# Altium schematic sheet EMG.SchDoc
size Letter
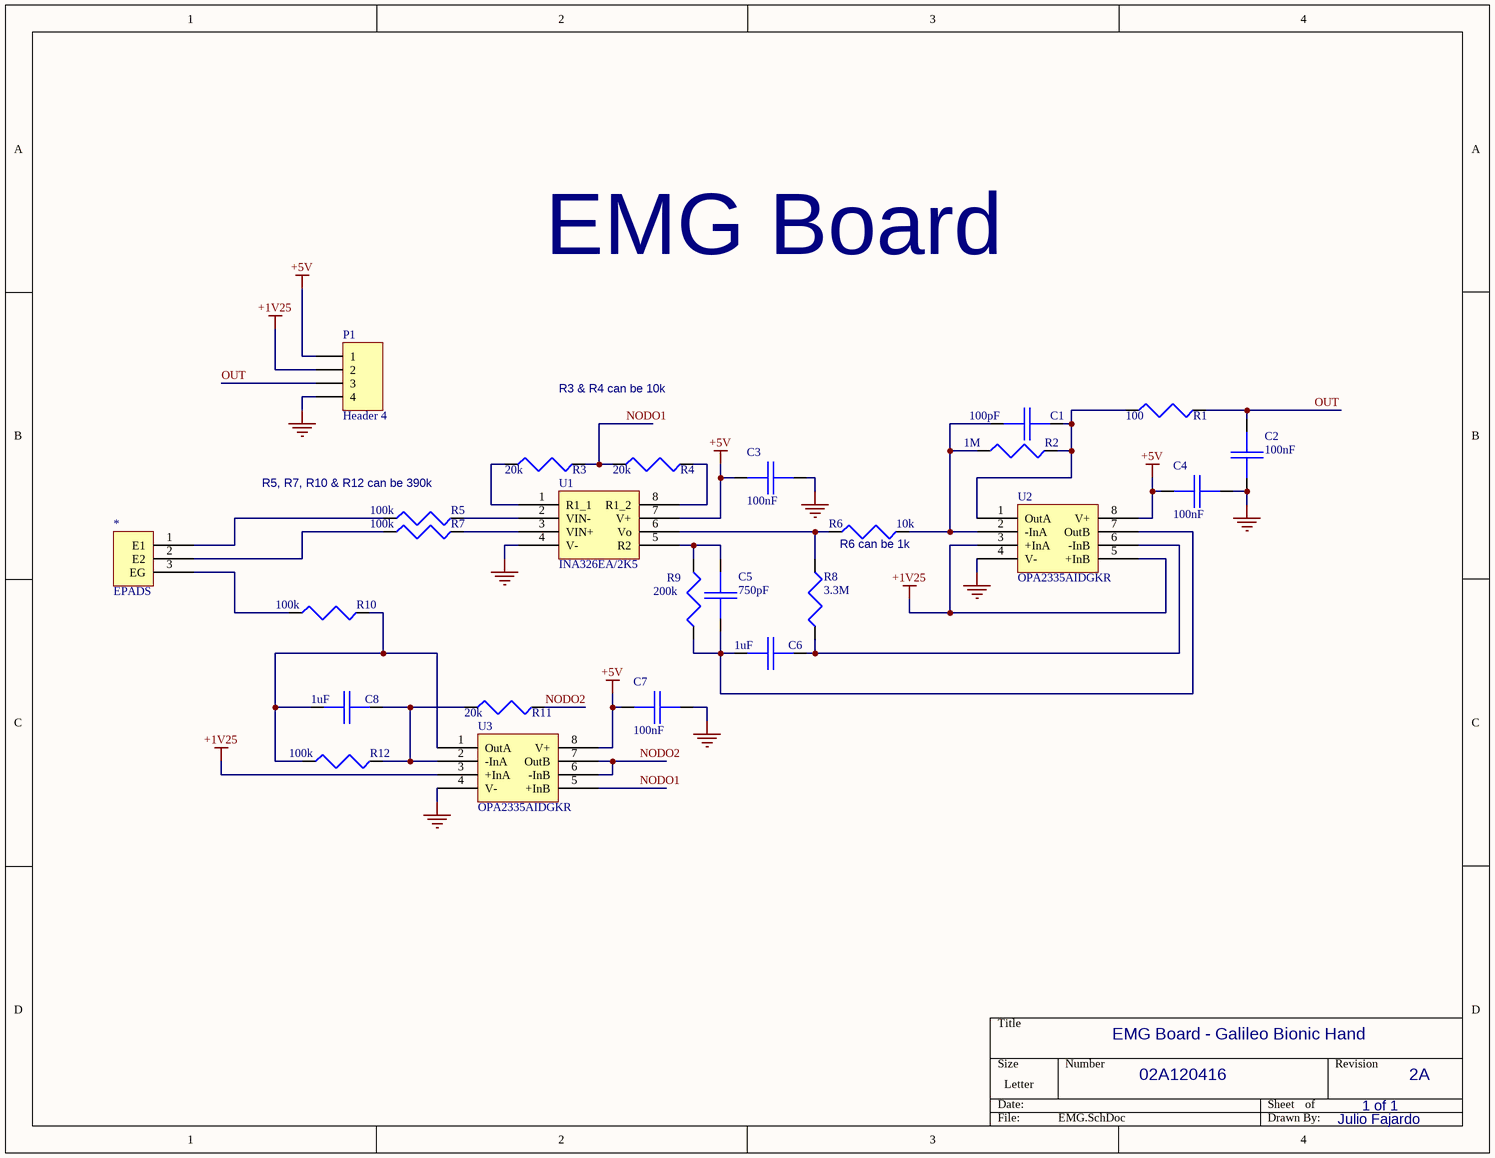
[diagram p0: EMG.SchDoc]

## Parts
*  EPADS  [PADS]
C1  100pF  [C0603]
C2  100nF  [C0603]
C3  100nF  [C0603]
C4  100nF  [C0603]
C5  750pF  [C0603]
C6  1uF  [C0603]
C7  100nF  [C0603]
C8  1uF  [C0603]
P1  Header 4  [HDR1X4]
R1  100  [R0603]
R2  1M  [R0603]
R3  20k  [R0603]
R4  20k  [R0603]
R5  100k  [R0603]
R6  10k  [R0603]
R7  100k  [R0603]
R8  3.3M  [R0402]
R9  200k  [R0603]
R10  100k  [R0603]
R11  20k  [R0603]
R12  100k  [R0603]
U1  INA326EA/2K5  [VSOP8]
U2  OPA2335AIDGKR  [VSOP8]
U3  OPA2335AIDGKR  [VSOP8]

## Nets
+1V25: P1.2 U2.3(+InA) U2.5(+InB) U3.3(+InA)
+5V: C3.2 C4.2 C7.2 P1.1 U1.7(V+) U2.8(V+) U3.8(V+)
GND: C2.2 C3.1 C4.1 C7.1 P1.4 U1.4(V-) U2.4(V-) U3.4(V-)
NODO1: R3.2 R4.1 U3.5(+InB)
NODO2: R11.2 U3.6(-InB) U3.7(OutB)
OUT: C2.1 P1.3 R1.2
Net*_1: *.1(E1) R5.1
Net*_2: *.2(E2) R7.1
Net*_3: *.3(EG) R10.1
NetC1_1: C1.1 R2.1 R6.2 U2.2(-InA)
NetC1_2: C1.2 R1.1 R2.2 U2.1(OutA)
NetC5_1: C5.1 C6.1 R9.1 U2.7(OutB)
NetC5_2: C5.2 R9.2 U1.5(R2)
NetC6_2: C6.2 R8.1 U2.6(-InB)
NetC8_1: C8.1 R10.2 R12.1 U3.1(OutA)
NetC8_2: C8.2 R11.1 R12.2 U3.2(-InA)
NetR3_1: R3.1 U1.1(R1_1)
NetR4_2: R4.2 U1.8(R1_2)
NetR5_2: R5.2 U1.2(VIN-)
NetR6_1: R6.1 R8.2 U1.6(Vo)
NetR7_2: R7.2 U1.3(VIN+)

## Notes on the sheet
- EMG Board
- R3 & R4 can be 10k
- R5, R7, R10 & R12 can be 390k
- (near R6) R6 can be 1k
- EMG Board - Galileo Bionic Hand
- 02A120416
- 1 of 1
- 2A
- Julio Fajardo

## Library data of the parts
* = PADS
C1 = 06033C101KAT2A: CAP CER 100PF 25V X7R 0603; Manufacturer: AVX Corporation; Tolerance: ±10%; Supplier 1: Digi-Key; Manufacturer Part Number: 06033C101KAT2A; RoHS: RoHS Compliant; Category: Capacitors; Stock 1: 34346; Pricing 1: 1=0.23, 10=0.157, 100=0.0798, 250=0.0646, 500=0.057, 1000=0.04845 (USD); Packaging: Cut Tape (CT); Capacitance: 100pF; Voltage - Rated: 25V; Temperature Coefficient: X7R; Mounting Type: Surface Mount, MLCC; Operating Temperature: -55°C ~ 125°C; Applications: General Purpose; Ratings: -; Package / Case: 0603 (1608 Metric); Size / Dimension: 0.063" L x 0.032" W (1.60mm x 0.81mm); Height - Seated (Max): -; Thickness (Max): 0.035" (0.90mm); Lead Spacing: -; Features: -; Lead Style: -; ComponentLink1URL: http://datasheets.avx.com/X7RDielectric.pdf; ComponentLink1Description: http://datasheets.avx.com/X7RDielectric.pdf; Supplier Part Number 1: 478-7899-1-ND
C2-C4 C7 = GRM188R71E104KA01D: CAP CER 0.1UF 25V X7R 0603; Manufacturer: Murata Electronics North America; Capacitance: 0.1µF; Tolerance: ±10%; Supplier 1: Digi-Key; Manufacturer Part Number: GRM188R71E104KA01D; RoHS: RoHS Compliant; Category: Capacitors; Stock 1: 5973420; Pricing 1: 1=0.1, 10=0.019, 50=0.0104, 100=0.0088, 250=0.0072, 500=0.00616, 1000=0.0048 (USD); Packaging: Cut Tape (CT); Voltage - Rated: 25V; Temperature Coefficient: X7R; Mounting Type: Surface Mount, MLCC; Operating Temperature: -55°C ~ 125°C; Applications: General Purpose; Ratings: -; Package / Case: 0603 (1608 Metric); Size / Dimension: 0.063" L x 0.031" W (1.60mm x 0.80mm); Height - Seated (Max): -; Thickness (Max): 0.035" (0.90mm); Lead Spacing: -; Features: -; Lead Style: -; ComponentLink1URL: http://www.murata.com/~/media/webrenewal/support/library/catalog/products/capacitor/mlcc/c02e.pdf; ComponentLink1Description: http://www.murata.com/~/media/webrenewal/support/library/catalog/products/capacitor/mlcc/c02e.pdf; Supplier Part Number 1: 490-1524-1-ND
C5 = GRM1885C1H751JA01D: CAP CER 750PF 50V NP0 0603; Manufacturer: Murata Electronics North America; Tolerance: ±5%; Temperature Coefficient: C0G, NP0; Supplier 1: Digi-Key; Manufacturer Part Number: GRM1885C1H751JA01D; RoHS: RoHS Compliant; Category: Capacitors; Stock 1: 30475; Pricing 1: 1=0.16, 10=0.112, 25=0.084, 50=0.0644, 100=0.0532, 250=0.0448, 500=0.03752, 1000=0.0308 (USD); Packaging: Cut Tape (CT); Capacitance: 750pF; Voltage - Rated: 50V; Mounting Type: Surface Mount, MLCC; Operating Temperature: -55°C ~ 125°C; Applications: General Purpose; Ratings: -; Package / Case: 0603 (1608 Metric); Size / Dimension: 0.063" L x 0.031" W (1.60mm x 0.80mm); Height - Seated (Max): -; Thickness (Max): 0.035" (0.90mm); Lead Spacing: -; Features: -; Lead Style: -; ComponentLink1URL: http://www.murata.com/~/media/webrenewal/support/library/catalog/products/capacitor/mlcc/c02e.pdf; ComponentLink1Description: http://www.murata.com/~/media/webrenewal/support/library/catalog/products/capacitor/mlcc/c02e.pdf; Supplier Part Number 1: 490-1448-1-ND
C6 C8 = GRM188R61E105KA12D: CAP CER 1UF 25V X5R 0603; Manufacturer: Murata Electronics North America; Capacitance: 1µF; Tolerance: ±10%; Supplier 1: Digi-Key; Manufacturer Part Number: GRM188R61E105KA12D; RoHS: RoHS Compliant; Category: Capacitors; Stock 1: 1934941; Pricing 1: 1=0.1, 10=0.044, 50=0.0238, 100=0.0202, 250=0.01652, 500=0.01412, 1000=0.01101 (USD); Packaging: Cut Tape (CT); Voltage - Rated: 25V; Temperature Coefficient: X5R; Mounting Type: Surface Mount, MLCC; Operating Temperature: -55°C ~ 85°C; Applications: General Purpose; Ratings: -; Package / Case: 0603 (1608 Metric); Size / Dimension: 0.063" L x 0.031" W (1.60mm x 0.80mm); Height - Seated (Max): -; Thickness (Max): 0.035" (0.90mm); Lead Spacing: -; Features: -; Lead Style: -; ComponentLink1URL: http://www.murata.com/~/media/webrenewal/support/library/catalog/products/capacitor/mlcc/c02e.pdf; ComponentLink1Description: http://www.murata.com/~/media/webrenewal/support/library/catalog/products/capacitor/mlcc/c02e.pdf; Supplier Part Number 1: 490-3897-1-ND
P1 = Header 4: Header, 4-Pin; LatestRevisionDate: 17-Jul-2002; LatestRevisionNote: Re-released for DXP Platform.; Publisher: Altium Limited
R1 = ERJ-3EKF1000V: RES SMD 100 OHM 1% 1/10W 0603; Manufacturer: Panasonic Electronic Components; Power (Watts): 0.1W, 1/10W; Temperature Coefficient: ±100ppm/°C; Supplier 1: Digi-Key; Manufacturer Part Number: ERJ-3EKF1000V; RoHS: RoHS Compliant; Category: Resistors; Stock 1: 2225240; Pricing 1: 1=0.1, 50=0.0114, 100=0.0084, 250=0.00644, 500=0.00514, 1000=0.00379 (USD); Packaging: Cut Tape (CT); Resistance (Ohms): 100; Tolerance: ±1%; Composition: Thick Film; Features: Automotive AEC-Q200; Operating Temperature: -55°C ~ 155°C; Package / Case: 0603 (1608 Metric); Supplier Device Package: 0603; Size / Dimension: 0.063" L x 0.031" W (1.60mm x 0.80mm); Height: 0.022" (0.55mm); Number of Terminations: 2; ComponentLink1URL: http://industrial.panasonic.com/www-cgi/jvcr13pz.cgi?E+PZ+3+AOA0002+ERJ3EKF1000V+7+WW; ComponentLink1Description: http://industrial.panasonic.com/www-cgi/jvcr13pz.cgi?E+PZ+3+AOA0002+ERJ3EKF1000V+7+WW; Supplier Part Number 1: P100HCT-ND
R2 = MCT06030C1004FP500: RES SMD 1M OHM 1% 1/8W 0603; Manufacturer: Vishay Beyschlag; Power (Watts): 0.125W, 1/8W; Temperature Coefficient: ±50ppm/°C; Supplier 1: Digi-Key; Manufacturer Part Number: MCT06030C1004FP500; RoHS: RoHS Compliant; Category: Resistors; Stock 1: 53165; Pricing 1: 1=0.17, 10=0.145, 25=0.1056, 50=0.0766, 100=0.0568, 250=0.04356, 500=0.03432, 1000=0.02376, 2500=0.02178 (USD); Packaging: Cut Tape (CT); Resistance (Ohms): 1M; Tolerance: ±1%; Composition: Thin Film; Features: -; Operating Temperature: -55°C ~ 155°C; Package / Case: 0603 (1608 Metric); Supplier Device Package: 0603; Size / Dimension: 0.061" L x 0.033" W (1.55mm x 0.85mm); Height: 0.022" (0.55mm); Number of Terminations: 2; ComponentLink1URL: http://www.vishay.com/docs/28705/mcx0x0xpro.pdf; ComponentLink1Description: http://www.vishay.com/docs/28705/mcx0x0xpro.pdf; Supplier Part Number 1: MCT0603-1.00M-CFCT-ND
R3 R4 R11 = ERJ-3EKF2002V: RES SMD 20K OHM 1% 1/10W 0603; Manufacturer: Panasonic Electronic Components; Power (Watts): 0.1W, 1/10W; Temperature Coefficient: ±100ppm/°C; Supplier 1: Digi-Key; Manufacturer Part Number: ERJ-3EKF2002V; RoHS: RoHS Compliant; Category: Resistors; Stock 1: 1307644; Pricing 1: 1=0.1, 50=0.0114, 100=0.0084, 250=0.00644, 500=0.00514, 1000=0.00379 (USD); Packaging: Cut Tape (CT); Resistance (Ohms): 20k; Tolerance: ±1%; Composition: Thick Film; Features: Automotive AEC-Q200; Operating Temperature: -55°C ~ 155°C; Package / Case: 0603 (1608 Metric); Supplier Device Package: 0603; Size / Dimension: 0.063" L x 0.031" W (1.60mm x 0.80mm); Height: 0.022" (0.55mm); Number of Terminations: 2; ComponentLink1URL: http://industrial.panasonic.com/www-cgi/jvcr13pz.cgi?E+PZ+3+AOA0002+ERJ3EKF2002V+7+WW; ComponentLink1Description: http://industrial.panasonic.com/www-cgi/jvcr13pz.cgi?E+PZ+3+AOA0002+ERJ3EKF2002V+7+WW; Supplier Part Number 1: P20.0KHCT-ND
R5 R7 R10 R12 = MCT06030C1003FP500: RES SMD 100K OHM 1% 1/8W 0603; Manufacturer: Vishay Beyschlag; Power (Watts): 0.125W, 1/8W; Temperature Coefficient: ±50ppm/°C; Supplier 1: Digi-Key; Manufacturer Part Number: MCT06030C1003FP500; RoHS: RoHS Compliant; Category: Resistors; Stock 1: 147182; Pricing 1: 1=0.17, 10=0.145, 25=0.1056, 50=0.0766, 100=0.0568, 250=0.04356, 500=0.03432, 1000=0.02376, 2500=0.02178 (USD); Packaging: Cut Tape (CT); Resistance (Ohms): 100k; Tolerance: ±1%; Composition: Thin Film; Features: -; Operating Temperature: -55°C ~ 155°C; Package / Case: 0603 (1608 Metric); Supplier Device Package: 0603; Size / Dimension: 0.061" L x 0.033" W (1.55mm x 0.85mm); Height: 0.022" (0.55mm); Number of Terminations: 2; ComponentLink1URL: http://www.vishay.com/docs/28705/mcx0x0xpro.pdf; ComponentLink1Description: http://www.vishay.com/docs/28705/mcx0x0xpro.pdf; Supplier Part Number 1: MCT0603-100K-CFCT-ND
R6 = MCT06030C1002FP500: RES SMD 10K OHM 1% 1/8W 0603; Manufacturer: Vishay Beyschlag; Power (Watts): 0.125W, 1/8W; Temperature Coefficient: ±50ppm/°C; Supplier 1: Digi-Key; Manufacturer Part Number: MCT06030C1002FP500; RoHS: RoHS Compliant; Category: Resistors; Stock 1: 54494; Pricing 1: 1=0.17, 10=0.145, 25=0.1056, 50=0.0766, 100=0.0568, 250=0.04356, 500=0.03432, 1000=0.02376, 2500=0.02178 (USD); Packaging: Cut Tape (CT); Resistance (Ohms): 10k; Tolerance: ±1%; Composition: Thin Film; Features: -; Operating Temperature: -55°C ~ 155°C; Package / Case: 0603 (1608 Metric); Supplier Device Package: 0603; Size / Dimension: 0.061" L x 0.033" W (1.55mm x 0.85mm); Height: 0.022" (0.55mm); Number of Terminations: 2; ComponentLink1URL: http://www.vishay.com/docs/28705/mcx0x0xpro.pdf; ComponentLink1Description: http://www.vishay.com/docs/28705/mcx0x0xpro.pdf; Supplier Part Number 1: MCT0603-10.0K-CFCT-ND
R8 = MCR01MRTJ335: RES SMD 3.3M OHM 5% 1/16W 0402; Manufacturer: Rohm Semiconductor; Power (Watts): 0.063W, 1/16W; Temperature Coefficient: ±200ppm/°C; Supplier 1: Digi-Key; Manufacturer Part Number: MCR01MRTJ335; RoHS: RoHS Compliant; Category: Resistors; Stock 1: 17860; Pricing 1: 1=0.1, 10=0.02, 25=0.0144, 100=0.0082, 250=0.00624, 500=0.00498, 1000=0.00367, 5000=0.00263 (USD); Packaging: Cut Tape (CT); Resistance (Ohms): 3.3M; Tolerance: ±5%; Composition: Thick Film; Features: -; Operating Temperature: -55°C ~ 155°C; Package / Case: 0402 (1005 Metric); Supplier Device Package: 0402 (1005 Metric); Size / Dimension: 0.039" L x 0.020" W (1.00mm x 0.50mm); Height: 0.016" (0.40mm); Number of Terminations: 2; ComponentLink1URL: http://rohmfs.rohm.com/en/products/databook/datasheet/passive/resistor/chip_resistor/mcr_g.pdf; ComponentLink1Description: http://rohmfs.rohm.com/en/products/databook/datasheet/passive/resistor/chip_resistor/mcr_g.pdf; Supplier Part Number 1: RHM3.3MCECT-ND
R9 = MCT06030C2003FP500: RES SMD 200K OHM 1% 1/8W 0603; Manufacturer: Vishay Beyschlag; Power (Watts): 0.125W, 1/8W; Temperature Coefficient: ±50ppm/°C; Supplier 1: Digi-Key; Manufacturer Part Number: MCT06030C2003FP500; RoHS: RoHS Compliant; Category: Resistors; Stock 1: 20312; Pricing 1: 1=0.17, 10=0.145, 25=0.1056, 50=0.0766, 100=0.0568, 250=0.04356, 500=0.03432, 1000=0.02376, 2500=0.02178 (USD); Packaging: Cut Tape (CT); Resistance (Ohms): 200k; Tolerance: ±1%; Composition: Thin Film; Features: -; Operating Temperature: -55°C ~ 155°C; Package / Case: 0603 (1608 Metric); Supplier Device Package: 0603; Size / Dimension: 0.061" L x 0.033" W (1.55mm x 0.85mm); Height: 0.022" (0.55mm); Number of Terminations: 2; ComponentLink1URL: http://www.vishay.com/docs/28705/mcx0x0xpro.pdf; ComponentLink1Description: http://www.vishay.com/docs/28705/mcx0x0xpro.pdf; Supplier Part Number 1: MCT0603-200K-CFCT-ND
U1 = INA326EA/2K5: IC OPAMP INSTR 1KHZ RRO 8VSSOP; Manufacturer: Texas Instruments; Amplifier Type: Instrumentation; Number of Circuits: 1; Output Type: Rail-to-Rail; Current - Input Bias: 200pA; Voltage - Input Offset: 20µV; Current - Supply: 2.4mA; Current - Output / Channel: 25mA; Voltage - Supply, Single/Dual (±): 2.7 V ~ 5.5 V, ±1.35 V ~ 2.75 V; Supplier 1: Digi-Key; Manufacturer Part Number: INA326EA/2K5; RoHS: RoHS Compliant; Category: Integrated Circuits (ICs); Stock 1: 3429; Pricing 1: 1=4.79, 10=4.3, 100=3.5276, 500=3.00106, 1000=2.19375 (USD); Packaging: Cut Tape (CT); Slew Rate: -; Gain Bandwidth Product: -; -3db Bandwidth: 1kHz; Operating Temperature: -40°C ~ 85°C; Mounting Type: Surface Mount; Package / Case: 8-TSSOP, 8-MSOP (0.118", 3.00mm Width); Supplier Device Package: 8-VSSOP; ComponentLink1URL: http://www.ti.com/lit/ds/symlink/ina326.pdf; ComponentLink1Description: http://www.ti.com/lit/ds/symlink/ina326.pdf; Supplier Part Number 1: INA326EA/2K5CT-ND
U2 U3 = OPA2335AIDGKR: IC OPAMP CHOPPER 2MHZ RRO 8VSSOP; Manufacturer: Texas Instruments; Amplifier Type: Zero-Drift; Number of Circuits: 2; Output Type: Rail-to-Rail; Slew Rate: 1.6 V/µs; Current - Input Bias: 70pA; Voltage - Input Offset: 1µV; Current - Supply: 570µA; Current - Output / Channel: 50mA; Voltage - Supply, Single/Dual (±): 2.7 V ~ 5.5 V, ±1.35 V ~ 2.75 V; Supplier 1: Digi-Key; Manufacturer Part Number: OPA2335AIDGKR; RoHS: RoHS Compliant; Category: Integrated Circuits (ICs); Stock 1: 1271; Pricing 1: 1=4.15, 10=3.724, 100=3.0552, 500=2.5992, 1000=2.1888 (USD); Packaging: Cut Tape (CT); Gain Bandwidth Product: 2MHz; -3db Bandwidth: -; Operating Temperature: -40°C ~ 125°C; Mounting Type: Surface Mount; Package / Case: 8-TSSOP, 8-MSOP (0.118", 3.00mm Width); Supplier Device Package: 8-VSSOP; ComponentLink1URL: http://www.ti.com/lit/ds/symlink/opa334.pdf; ComponentLink1Description: http://www.ti.com/lit/ds/symlink/opa334.pdf; Supplier Part Number 1: 296-41350-1-ND